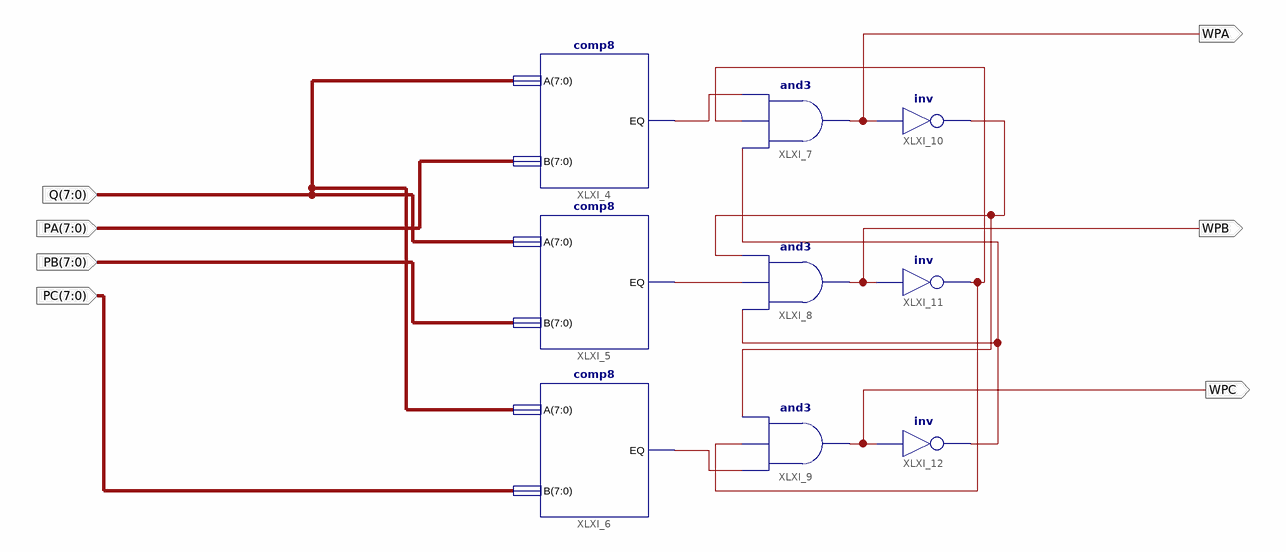
[diagram p0: schematic sheet 1]
// Xilinx ISE schematic answer.sch (spartan6) as structural Verilog: 9 symbols, 7 ports
module answer (
  input  [7:0] Q,
  input  [7:0] PB,
  input  [7:0] PA,
  input  [7:0] PC,
  output WPA,
  output WPB,
  output WPC
);

  wire XLXN_16, XLXN_18, XLXN_20, XLXN_23, XLXN_24, XLXN_25;

  comp8 XLXI_4 (.A(Q), .B(PA), .EQ(XLXN_23));
  comp8 XLXI_5 (.A(Q), .B(PB), .EQ(XLXN_24));
  and XLXI_7 (WPA, XLXN_16, XLXN_20, XLXN_23);
  and XLXI_8 (WPB, XLXN_16, XLXN_24, XLXN_18);
  and XLXI_9 (WPC, XLXN_25, XLXN_20, XLXN_18);
  not XLXI_10 (XLXN_18, WPA);
  not XLXI_11 (XLXN_20, WPB);
  not XLXI_12 (XLXN_16, WPC);
  comp8 XLXI_6 (.A(Q), .B(PC), .EQ(XLXN_25));
endmodule
